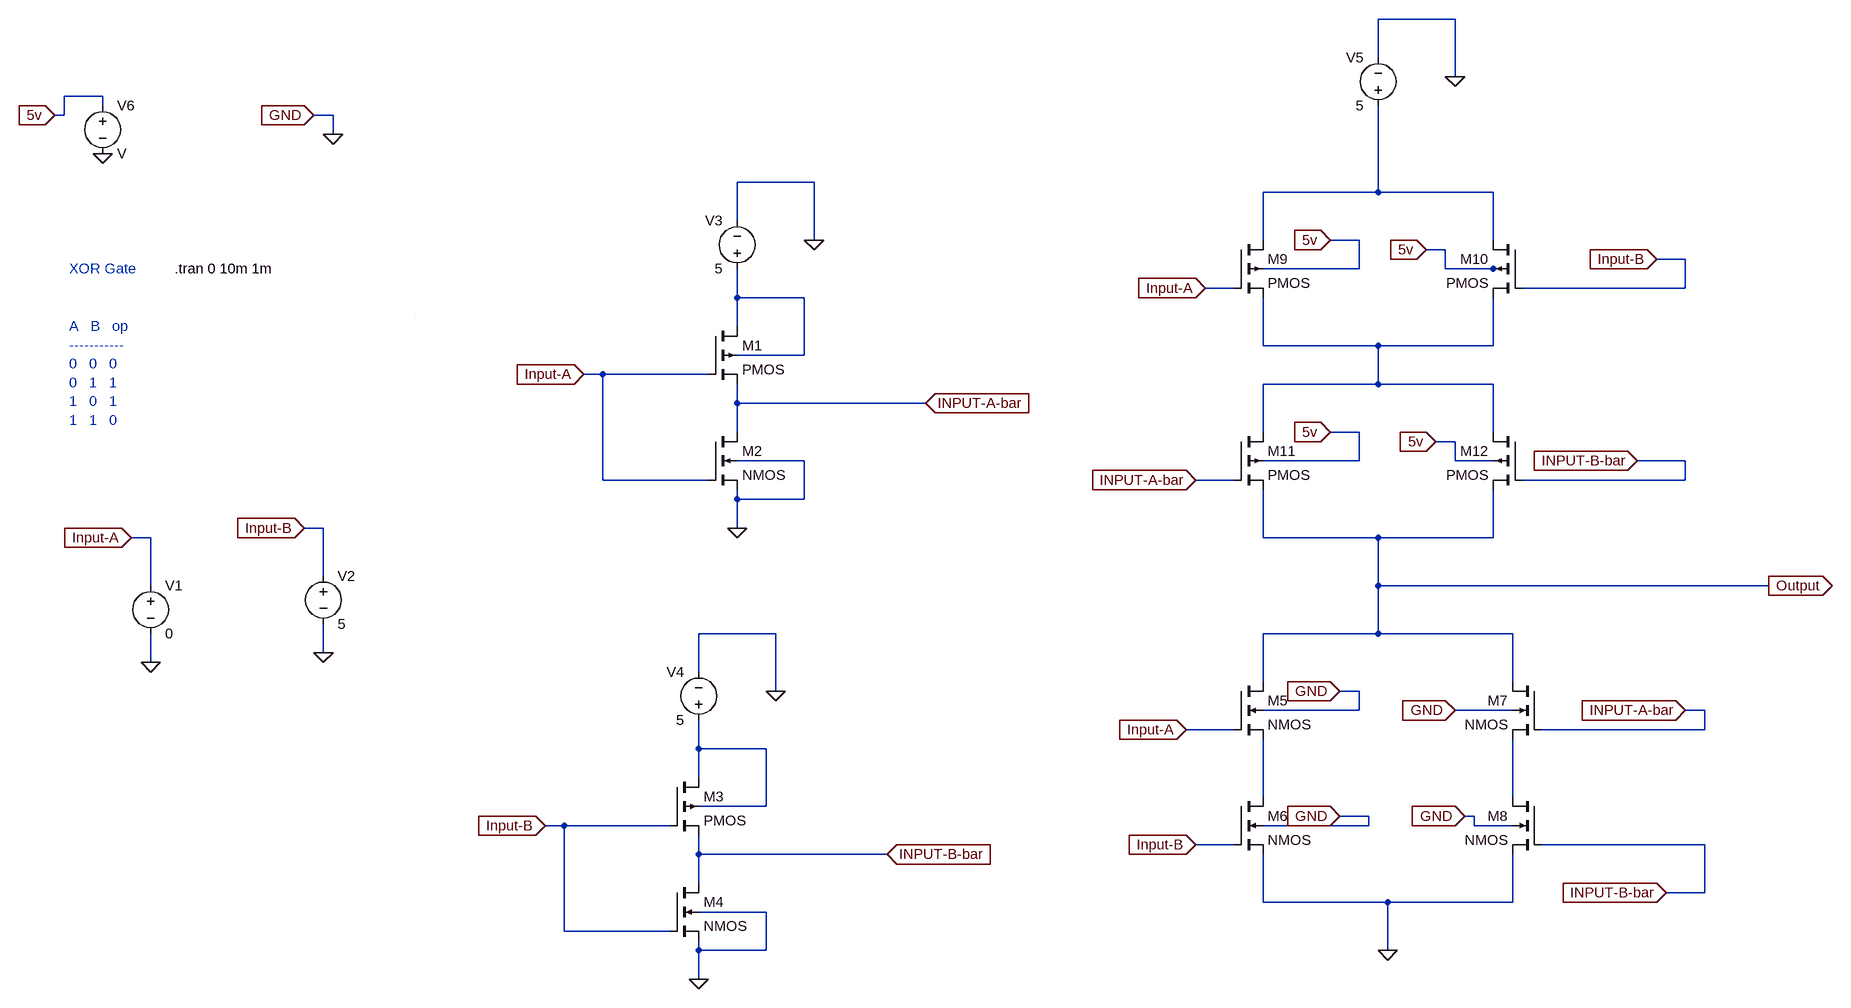
[diagram p0: schematic 6_XOR_gate.asc]
6_XOR_gate.asc, the LTspice schematic file:
Version 4.1
SHEET 1 3532 1124
WIRE 2336 -496 2208 -496
WIRE 2208 -432 2208 -496
WIRE 2336 -400 2336 -496
WIRE -528 -368 -592 -368
WIRE -528 -352 -528 -368
WIRE -592 -336 -592 -368
WIRE -592 -336 -608 -336
WIRE -144 -336 -176 -336
WIRE -144 -304 -144 -336
WIRE 736 -224 608 -224
WIRE 2208 -208 2208 -352
WIRE 2208 -208 2016 -208
WIRE 2400 -208 2208 -208
WIRE 608 -160 608 -224
WIRE 736 -128 736 -224
WIRE 2016 -128 2016 -208
WIRE 2176 -128 2128 -128
WIRE 2400 -128 2400 -208
WIRE 2320 -112 2288 -112
WIRE 2720 -96 2672 -96
WIRE 2176 -80 2176 -128
WIRE 2176 -80 2016 -80
WIRE 2320 -80 2320 -112
WIRE 2400 -80 2320 -80
WIRE 2416 -80 2400 -80
WIRE 1968 -48 1920 -48
WIRE 2720 -48 2720 -96
WIRE 2720 -48 2448 -48
WIRE 608 -32 608 -80
WIRE 720 -32 608 -32
WIRE 608 16 608 -32
WIRE 2016 48 2016 -32
WIRE 2208 48 2016 48
WIRE 2400 48 2400 -32
WIRE 2400 48 2208 48
WIRE 720 64 720 -32
WIRE 720 64 608 64
WIRE 384 96 352 96
WIRE 560 96 384 96
WIRE 2208 112 2208 48
WIRE 2208 112 2016 112
WIRE 2400 112 2208 112
WIRE 608 144 608 112
WIRE 992 144 608 144
WIRE 608 192 608 144
WIRE 2016 192 2016 112
WIRE 2176 192 2128 192
WIRE 2400 192 2400 112
WIRE 2336 208 2304 208
WIRE 720 240 608 240
WIRE 2176 240 2176 192
WIRE 2176 240 2016 240
WIRE 2336 240 2336 208
WIRE 2400 240 2336 240
WIRE 2720 240 2640 240
WIRE 384 272 384 96
WIRE 560 272 384 272
WIRE 1968 272 1904 272
WIRE 2720 272 2720 240
WIRE 2720 272 2448 272
WIRE 608 304 608 288
WIRE 720 304 720 240
WIRE 720 304 608 304
WIRE -160 352 -192 352
WIRE 608 352 608 304
WIRE -448 368 -480 368
WIRE 2016 368 2016 288
WIRE 2208 368 2016 368
WIRE 2400 368 2400 288
WIRE 2400 368 2208 368
WIRE -160 432 -160 352
WIRE -448 448 -448 368
WIRE 2208 448 2208 368
WIRE 3392 448 2208 448
WIRE 672 528 544 528
WIRE 2208 528 2208 448
WIRE 2208 528 2016 528
WIRE 2432 528 2208 528
WIRE -160 560 -160 512
WIRE -448 576 -448 528
WIRE 544 592 544 528
WIRE 2016 608 2016 528
WIRE 2432 608 2432 528
WIRE 672 624 672 528
WIRE 2176 624 2144 624
WIRE 2176 656 2176 624
WIRE 2176 656 2016 656
WIRE 2432 656 2336 656
WIRE 2752 656 2720 656
WIRE 1968 688 1888 688
WIRE 2752 688 2752 656
WIRE 2752 688 2480 688
WIRE 544 720 544 672
WIRE 656 720 544 720
WIRE 544 768 544 720
WIRE 2016 800 2016 704
WIRE 2432 800 2432 704
WIRE 656 816 656 720
WIRE 656 816 544 816
WIRE 2192 832 2144 832
WIRE 2368 832 2352 832
WIRE 320 848 288 848
WIRE 496 848 320 848
WIRE 2192 848 2192 832
WIRE 2192 848 2016 848
WIRE 2368 848 2368 832
WIRE 2432 848 2368 848
WIRE 1968 880 1904 880
WIRE 2752 880 2480 880
WIRE 544 896 544 864
WIRE 928 896 544 896
WIRE 544 944 544 896
WIRE 2752 960 2752 880
WIRE 2752 960 2688 960
WIRE 2016 976 2016 896
WIRE 2224 976 2016 976
WIRE 2432 976 2432 896
WIRE 2432 976 2224 976
WIRE 656 992 544 992
WIRE 320 1024 320 848
WIRE 496 1024 320 1024
WIRE 544 1056 544 1040
WIRE 656 1056 656 992
WIRE 656 1056 544 1056
WIRE 2224 1056 2224 976
WIRE 544 1104 544 1056
WIRE 0 0 0 0
FLAG -448 576 0
FLAG -480 368 Input-A
IOPIN -480 368 In
FLAG -160 560 0
FLAG -192 352 Input-B
IOPIN -192 352 In
FLAG 992 144 INPUT-A-bar
IOPIN 992 144 In
FLAG 608 352 0
FLAG 736 -128 0
FLAG 352 96 Input-A
IOPIN 352 96 In
FLAG 928 896 INPUT-B-bar
IOPIN 928 896 In
FLAG 544 1104 0
FLAG 672 624 0
FLAG 288 848 Input-B
IOPIN 288 848 In
FLAG 2224 1056 0
FLAG 2336 -400 0
FLAG 1888 688 Input-A
IOPIN 1888 688 In
FLAG 2720 656 INPUT-A-bar
IOPIN 2720 656 In
FLAG 3392 448 Output
IOPIN 3392 448 Out
FLAG 1920 -48 Input-A
IOPIN 1920 -48 In
FLAG 1904 272 INPUT-A-bar
IOPIN 1904 272 In
FLAG 1904 880 Input-B
IOPIN 1904 880 In
FLAG 2688 960 INPUT-B-bar
IOPIN 2688 960 In
FLAG 2672 -96 Input-B
IOPIN 2672 -96 In
FLAG 2640 240 INPUT-B-bar
IOPIN 2640 240 In
FLAG -176 -336 GND
IOPIN -176 -336 In
FLAG -144 -304 0
FLAG -528 -272 0
FLAG -608 -336 5v
IOPIN -608 -336 In
FLAG 2288 -112 5v
IOPIN 2288 -112 In
FLAG 2128 -128 5v
IOPIN 2128 -128 In
FLAG 2304 208 5v
IOPIN 2304 208 In
FLAG 2128 192 5v
IOPIN 2128 192 In
FLAG 2336 656 GND
IOPIN 2336 656 In
FLAG 2144 624 GND
IOPIN 2144 624 In
FLAG 2352 832 GND
IOPIN 2352 832 In
FLAG 2144 832 GND
IOPIN 2144 832 In
SYMBOL voltage -448 432 R0
WINDOW 123 0 0 Left 0
WINDOW 39 0 0 Left 0
SYMATTR InstName V1
SYMATTR Value 0
SYMBOL voltage -160 416 R0
WINDOW 123 0 0 Left 0
WINDOW 39 0 0 Left 0
SYMATTR InstName V2
SYMATTR Value 5
SYMBOL pmos4 560 16 R0
SYMATTR InstName M1
SYMBOL nmos4 560 192 R0
SYMATTR InstName M2
SYMBOL voltage 608 -64 R180
WINDOW 0 24 96 Left 2
WINDOW 3 24 16 Left 2
WINDOW 123 0 0 Left 0
WINDOW 39 0 0 Left 0
SYMATTR InstName V3
SYMATTR Value 5
SYMBOL pmos4 496 768 R0
SYMATTR InstName M3
SYMBOL nmos4 496 944 R0
SYMATTR InstName M4
SYMBOL voltage 544 688 R180
WINDOW 0 24 96 Left 2
WINDOW 3 24 16 Left 2
WINDOW 123 0 0 Left 0
WINDOW 39 0 0 Left 0
SYMATTR InstName V4
SYMATTR Value 5
SYMBOL nmos4 1968 608 R0
SYMATTR InstName M5
SYMBOL nmos4 1968 800 R0
SYMATTR InstName M6
SYMBOL nmos4 2480 608 M0
SYMATTR InstName M7
SYMBOL nmos4 2480 800 M0
SYMATTR InstName M8
SYMBOL pmos4 1968 -128 R0
SYMATTR InstName M9
SYMBOL pmos4 2448 -128 M0
SYMATTR InstName M10
SYMBOL pmos4 1968 192 R0
SYMATTR InstName M11
SYMBOL pmos4 2448 192 M0
SYMATTR InstName M12
SYMBOL voltage 2208 -336 R180
WINDOW 0 24 96 Left 2
WINDOW 3 24 16 Left 2
WINDOW 123 0 0 Left 0
WINDOW 39 0 0 Left 0
SYMATTR InstName V5
SYMATTR Value 5
SYMBOL voltage -528 -368 R0
SYMATTR InstName V6
TEXT -408 -80 Left 2 !.tran 0 10m 1m
TEXT -584 -80 Left 2 ;XOR Gate
TEXT -584 16 Left 2 ;A   B   op\n-----------\n0   0   0\n0   1   1\n1   0   1\n1   1   0

The netlist it stands for:
* 6_XOR_gate.asc
V1 Input-A 0 0
V2 Input-B 0 5
M1 N002 Input-A INPUT-A-bar N002 PMOS
M2 INPUT-A-bar Input-A 0 0 NMOS
V3 N002 0 5
M3 N004 Input-B INPUT-B-bar N004 PMOS
M4 INPUT-B-bar Input-B 0 0 NMOS
V4 N004 0 5
M5 Output Input-A N005 0 NMOS
M6 N005 Input-B 0 0 NMOS
M7 Output INPUT-A-bar N006 0 NMOS
M8 N006 INPUT-B-bar 0 0 NMOS
M9 N001 Input-A N003 5v PMOS
M10 N001 Input-B N003 5v PMOS
M11 N003 INPUT-A-bar Output 5v PMOS
M12 N003 INPUT-B-bar Output 5v PMOS
V5 N001 0 5
V6 5v 0 V
.model NMOS NMOS
.model PMOS PMOS
.lib standard.mos
.tran 0 10m 1m
* XOR Gate
* A   B   op
* -----------
* 0   0   0
* 0   1   1
* 1   0   1
* 1   1   0
.backanno
.end